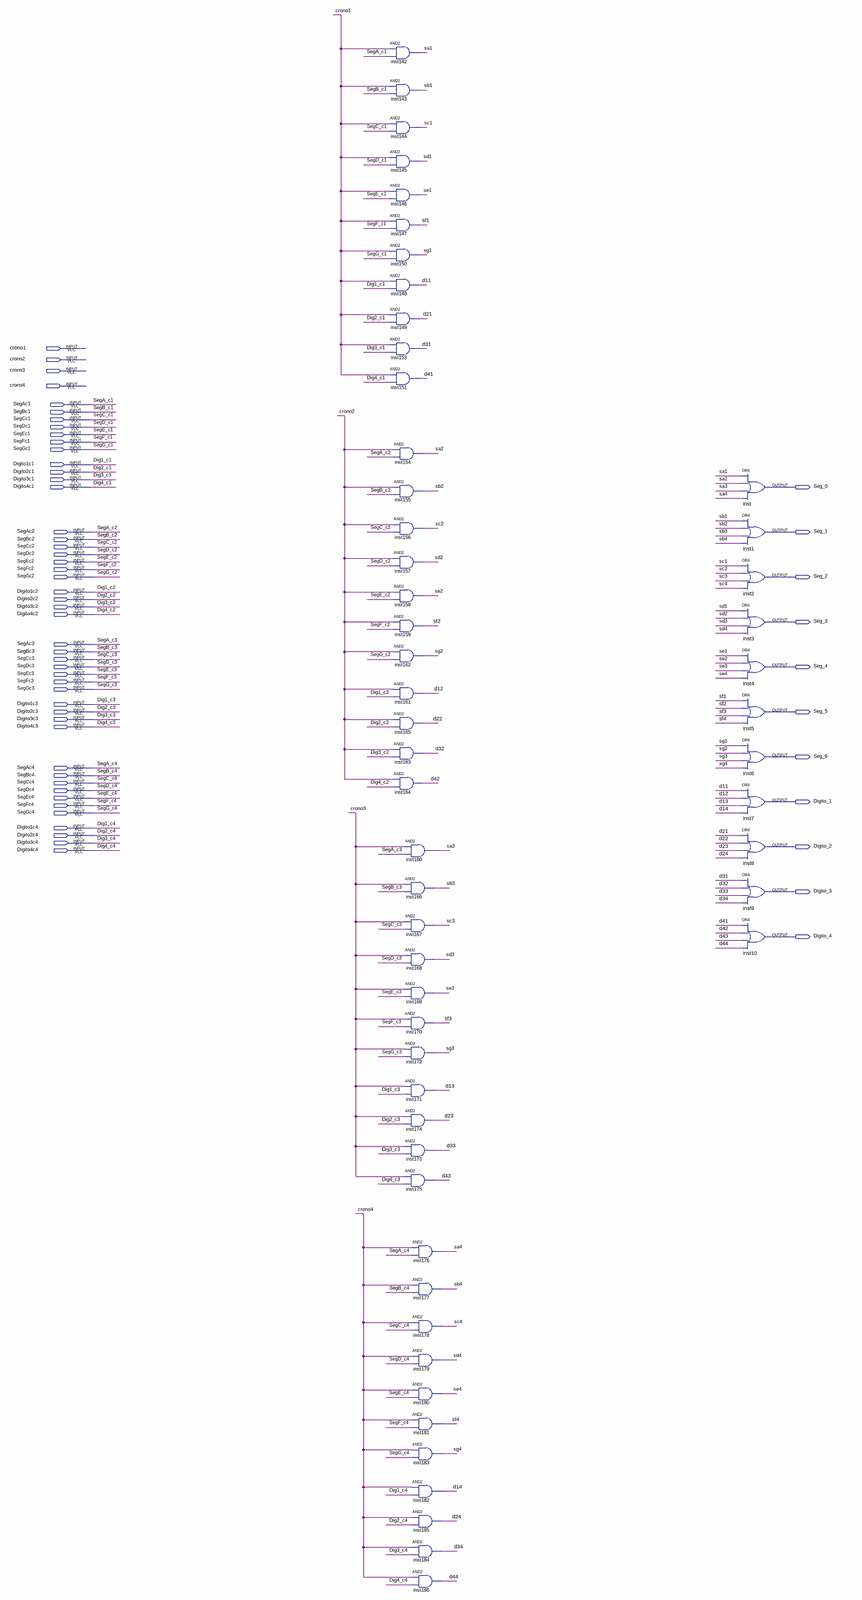
[diagram p0: schematic sheet, whole]
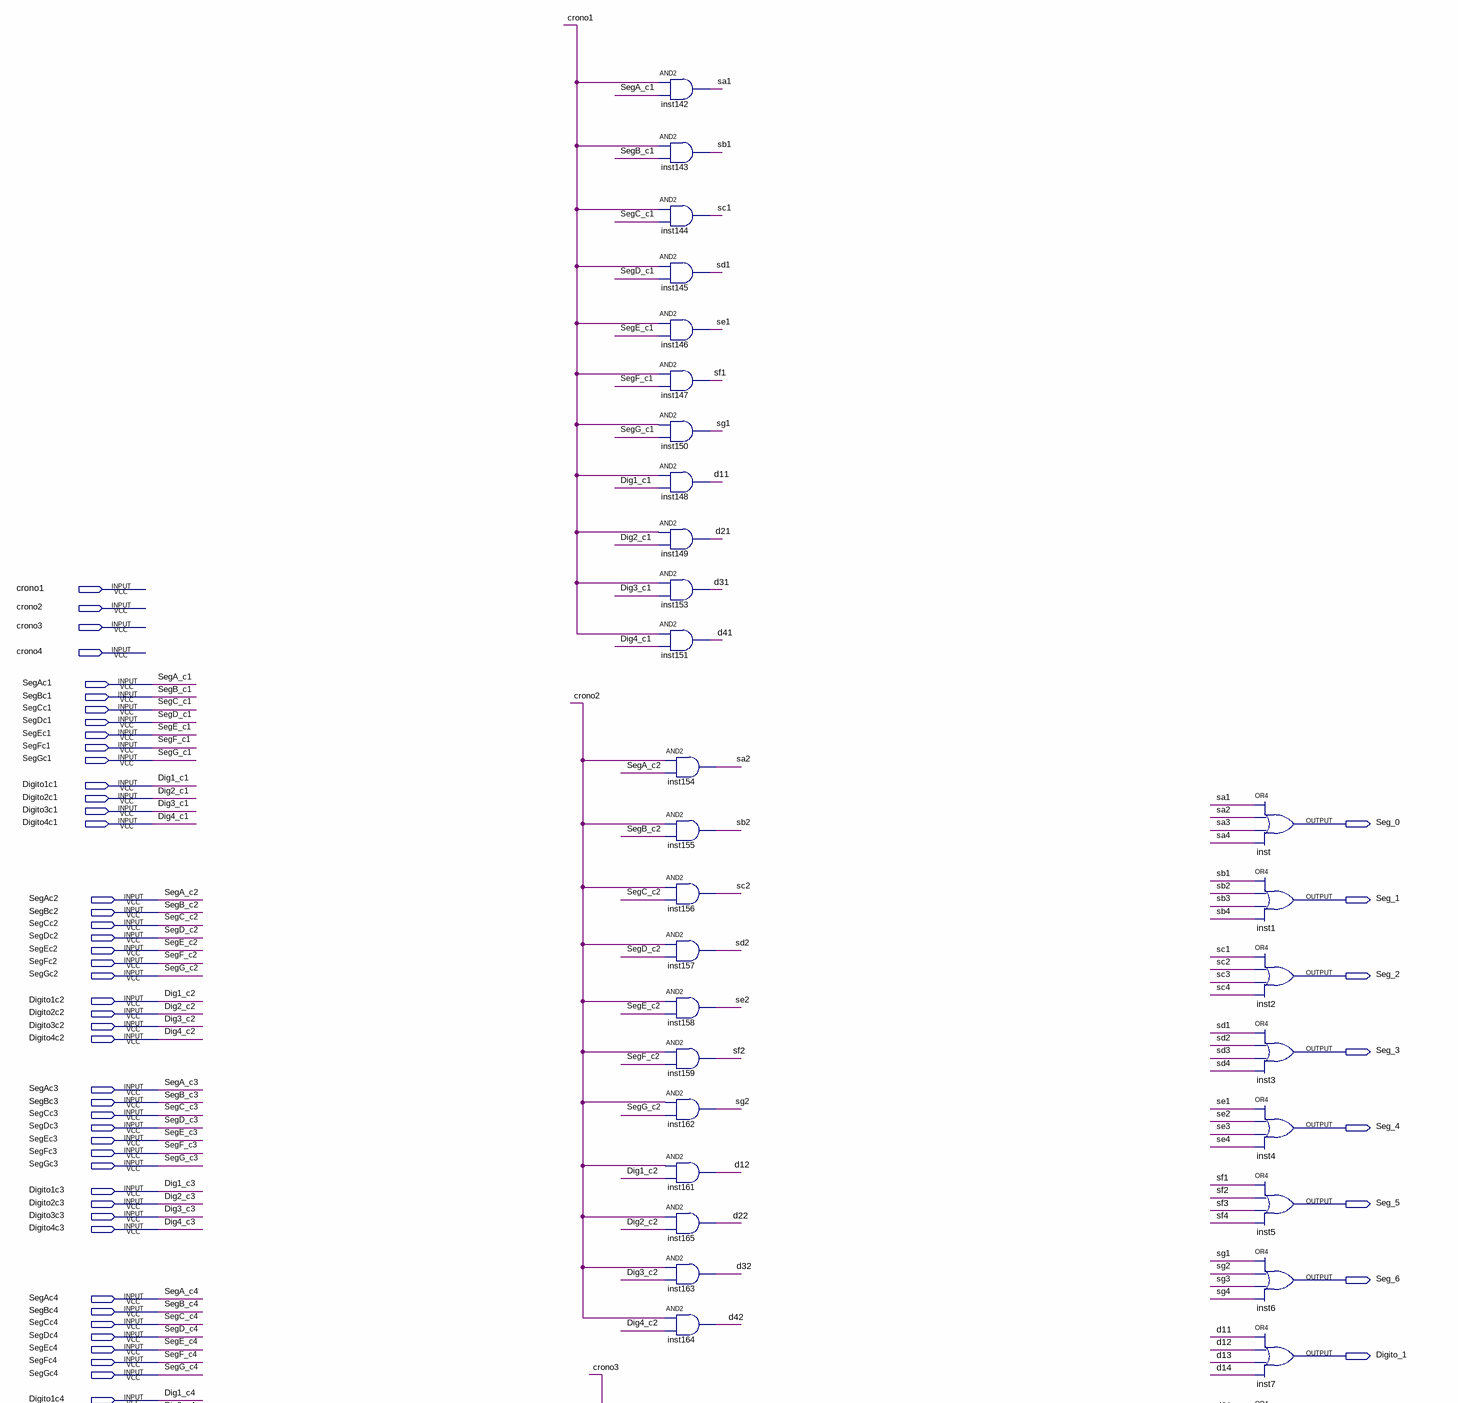
[diagram p1: schematic sheet, upper part]
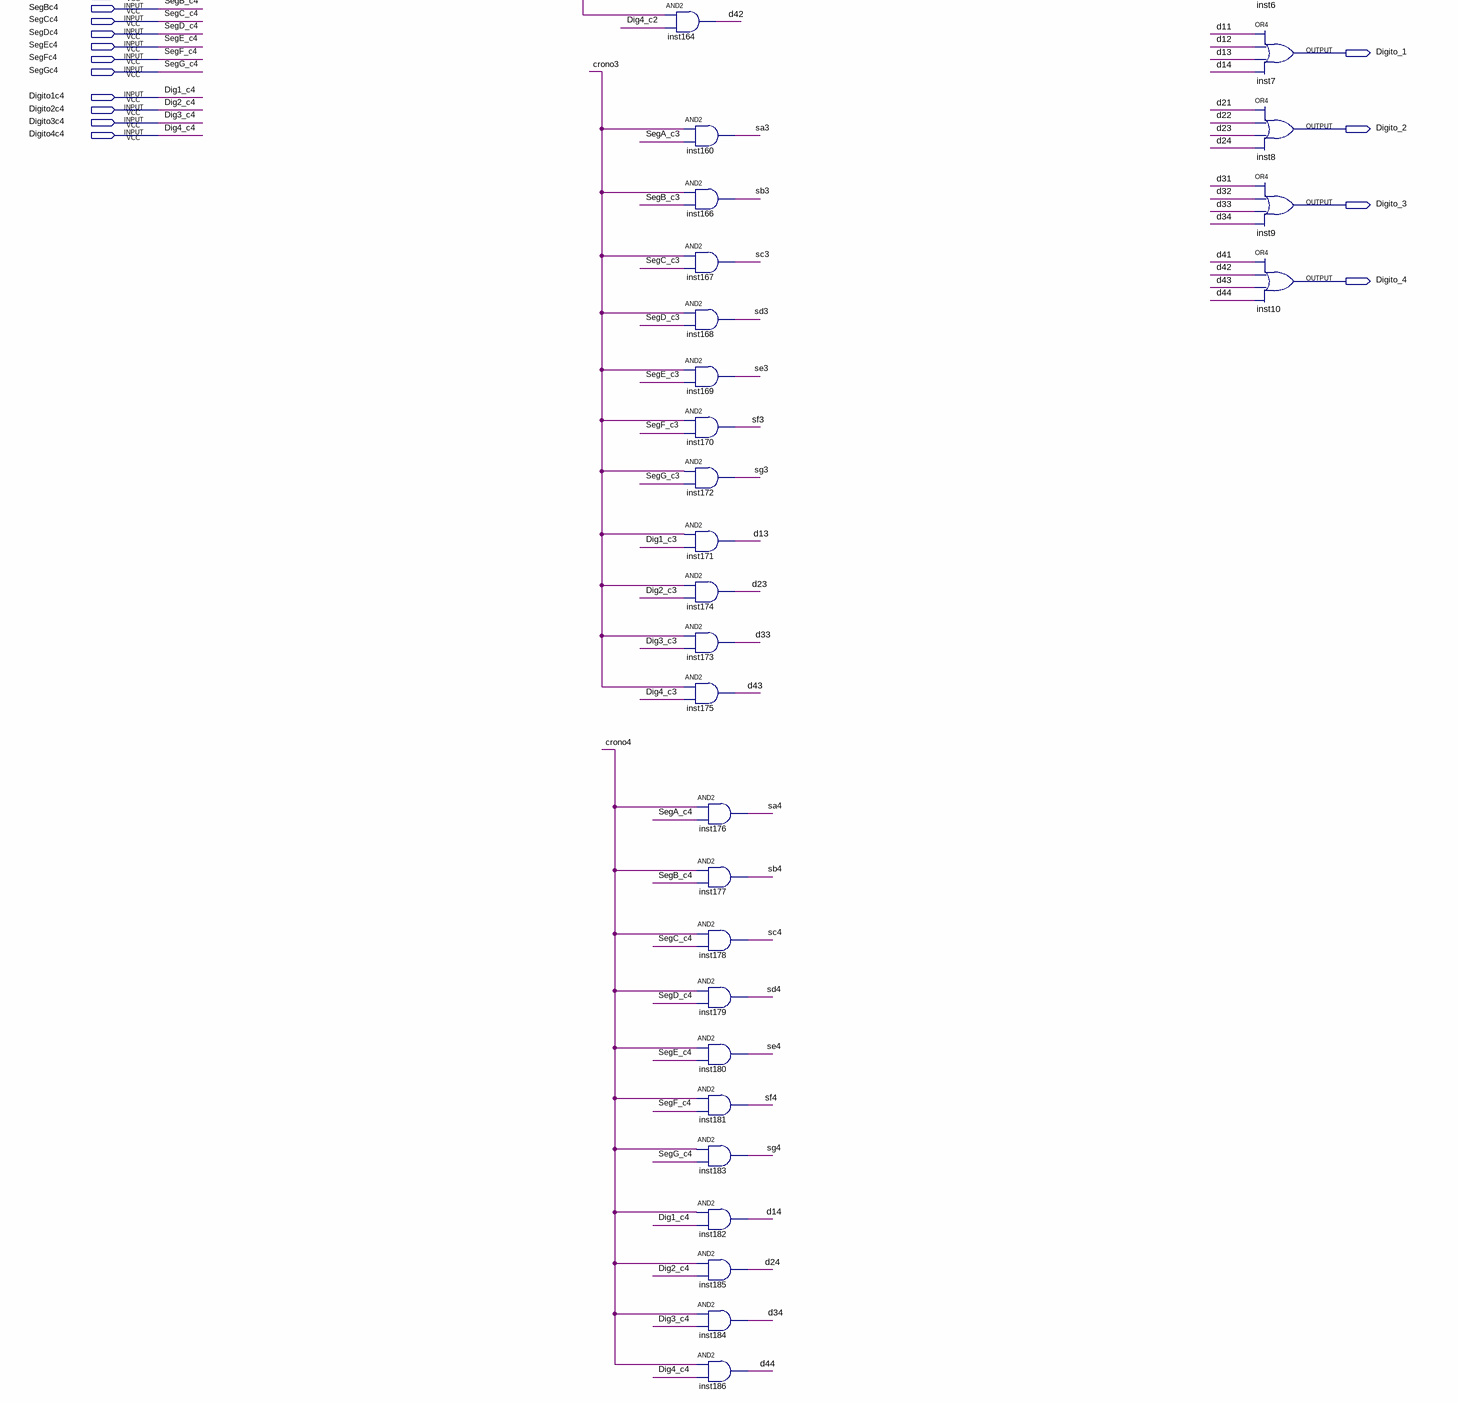
[diagram p2: schematic sheet, lower part]
// Quartus schematic Multiplex_cronometros.bdf as structural Verilog: 55 symbols, 59 pins
module Multiplex_cronometros (
  input  crono1,
  input  crono2,
  input  crono3,
  input  crono4,
  input  SegAc1,
  input  SegBc1,
  input  SegCc1,
  input  SegDc1,
  input  SegEc1,
  input  SegFc1,
  input  SegGc1,
  input  Digito1c1,
  input  Digito2c1,
  input  Digito3c1,
  input  Digito4c1,
  input  SegAc2,
  input  SegBc2,
  input  SegCc2,
  input  SegDc2,
  input  SegEc2,
  input  SegFc2,
  input  SegGc2,
  input  Digito1c2,
  input  Digito2c2,
  input  Digito3c2,
  input  Digito4c2,
  input  SegAc3,
  input  SegBc3,
  input  SegCc3,
  input  SegDc3,
  input  SegEc3,
  input  SegFc3,
  input  SegGc3,
  input  Digito1c3,
  input  Digito2c3,
  input  Digito3c3,
  input  Digito4c3,
  input  SegAc4,
  input  SegBc4,
  input  SegCc4,
  input  SegDc4,
  input  SegEc4,
  input  SegFc4,
  input  SegGc4,
  input  Digito1c4,
  input  Digito2c4,
  input  Digito3c4,
  input  Digito4c4,
  output Seg_0,
  output Seg_1,
  output Seg_2,
  output Seg_3,
  output Seg_4,
  output Seg_5,
  output Seg_6,
  output Digito_1,
  output Digito_2,
  output Digito_3,
  output Digito_4
);

  wire d11, d12, d13, d14, d21, d22, d23, d24, d31, d32, d33, d34, d41, d42, d43, d44, sa1, sa2, sa3, sa4,
       sb1, sb2, sb3, sb4, sc1, sc2, sc3, sc4, sd1, sd2, sd3, sd4, se1, se2, se3, se4, sf1, sf2, sf3, sf4,
       sg1, sg2, sg3, sg4;

  and inst142 (sa1, crono1, SegAc1);
  and inst143 (sb1, crono1, SegBc1);
  and inst144 (sc1, crono1, SegCc1);
  and inst145 (sd1, crono1, SegDc1);
  and inst146 (se1, crono1, SegEc1);
  and inst147 (sf1, crono1, SegFc1);
  and inst150 (sg1, crono1, SegGc1);
  and inst148 (d11, crono1, Digito1c1);
  and inst149 (d21, crono1, Digito2c1);
  and inst153 (d31, crono1, Digito3c1);
  and inst151 (d41, crono1, Digito4c1);
  and inst154 (sa2, crono2, SegAc2);
  and inst155 (sb2, crono2, SegBc2);
  and inst156 (sc2, crono2, SegCc2);
  and inst157 (sd2, crono2, SegDc2);
  and inst158 (se2, crono2, SegEc2);
  and inst159 (sf2, crono2, SegFc2);
  and inst162 (sg2, crono2, SegGc2);
  and inst161 (d12, crono2, Digito1c2);
  and inst165 (d22, crono2, Digito2c2);
  and inst163 (d32, crono2, Digito3c2);
  and inst164 (d42, crono2, Digito4c2);
  and inst160 (sa3, crono3, SegAc3);
  and inst166 (sb3, crono3, SegBc3);
  and inst167 (sc3, crono3, SegCc3);
  and inst168 (sd3, crono3, SegDc3);
  and inst169 (se3, crono3, SegEc3);
  and inst170 (sf3, crono3, SegFc3);
  and inst172 (sg3, crono3, SegGc3);
  and inst171 (d13, crono3, Digito1c3);
  and inst174 (d23, crono3, Digito2c3);
  and inst173 (d33, crono3, Digito3c3);
  and inst175 (d43, crono3, Digito4c3);
  and inst176 (sa4, crono4, SegAc4);
  and inst177 (sb4, crono4, SegBc4);
  and inst178 (sc4, crono4, SegCc4);
  and inst179 (sd4, crono4, SegDc4);
  and inst180 (se4, crono4, SegEc4);
  and inst181 (sf4, crono4, SegFc4);
  and inst183 (sg4, crono4, SegGc4);
  and inst182 (d14, crono4, Digito1c4);
  and inst185 (d24, crono4, Digito2c4);
  and inst184 (d34, crono4, Digito3c4);
  and inst186 (d44, crono4, Digito4c4);
  or inst (Seg_0, sa1, sa2, sa3, sa4);
  or inst1 (Seg_1, sb1, sb2, sb3, sb4);
  or inst2 (Seg_2, sc1, sc2, sc3, sc4);
  or inst3 (Seg_3, sd1, sd2, sd3, sd4);
  or inst4 (Seg_4, se1, se2, se3, se4);
  or inst5 (Seg_5, sf1, sf2, sf3, sf4);
  or inst6 (Seg_6, sg1, sg2, sg3, sg4);
  or inst7 (Digito_1, d11, d12, d13, d14);
  or inst8 (Digito_2, d21, d22, d23, d24);
  or inst9 (Digito_3, d31, d32, d33, d34);
  or inst10 (Digito_4, d41, d42, d43, d44);

  // Other names for the same wires on the sheet: Dig1_c1 = Digito1c1; Dig1_c2 = Digito1c2; Dig1_c3 = Digito1c3;
  //   Dig1_c4 = Digito1c4; Dig2_c1 = Digito2c1; Dig2_c2 = Digito2c2; Dig2_c3 = Digito2c3; Dig2_c4 = Digito2c4;
  //   Dig3_c1 = Digito3c1; Dig3_c2 = Digito3c2; Dig3_c3 = Digito3c3; Dig3_c4 = Digito3c4; Dig4_c1 = Digito4c1;
  //   Dig4_c2 = Digito4c2; Dig4_c3 = Digito4c3; Dig4_c4 = Digito4c4; SegA_c1 = SegAc1; SegA_c2 = SegAc2;
  //   SegA_c3 = SegAc3; SegA_c4 = SegAc4; SegB_c1 = SegBc1; SegB_c2 = SegBc2; SegB_c3 = SegBc3; SegB_c4 = SegBc4;
  //   SegC_c1 = SegCc1; SegC_c2 = SegCc2; SegC_c3 = SegCc3; SegC_c4 = SegCc4; SegD_c1 = SegDc1; SegD_c2 = SegDc2;
  //   SegD_c3 = SegDc3; SegD_c4 = SegDc4; SegE_c1 = SegEc1; SegE_c2 = SegEc2; SegE_c3 = SegEc3; SegE_c4 = SegEc4;
  //   SegF_c1 = SegFc1; SegF_c2 = SegFc2; SegF_c3 = SegFc3; SegF_c4 = SegFc4; SegG_c1 = SegGc1; SegG_c2 = SegGc2;
  //   SegG_c3 = SegGc3; SegG_c4 = SegGc4
endmodule
